# Altium schematic sheet CAN.SchDoc
size A4
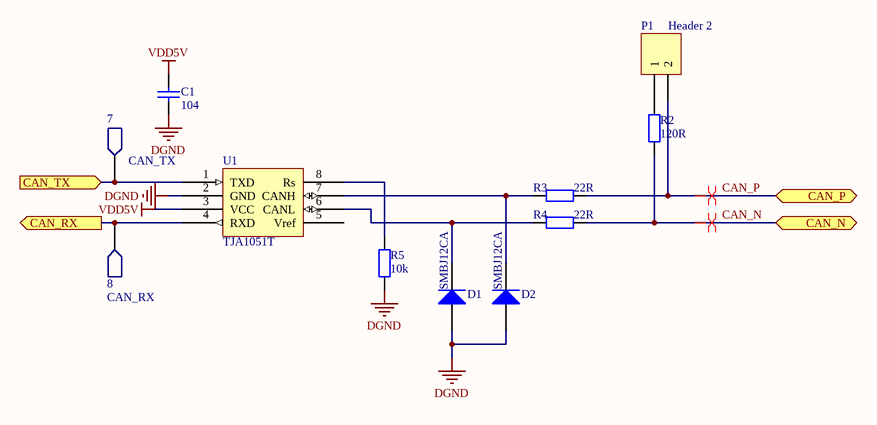
[diagram p0: CAN.SchDoc]

## Parts
7  CAN_TX  [testPoint]
8  CAN_RX  [testPoint]
C1  104  [0603_]
D1  SMBJ12CA  [SMB]
D2  SMBJ12CA  [SMB]
P1  Header 2  [HDR1X2]
R2  120R  [0603_]
R3  22R  [0603_]
R4  22R  [0603_]
R5  10k  [0603_]
U1  TJA1051T  [SOP8]

## Ports
CAN_N (bidir), CAN_P (bidir), CAN_RX (out), CAN_TX (in)

## Nets
DGND: C1.1 D1.A D2.A R5.1 U1.2(GND)
VDD5V: C1.2 U1.3(VCC)
CAN_N: R2.1 R4.1 ; port CAN_N
CAN_P: P1.2 R3.1 ; port CAN_P
CAN_RX: 8.1 U1.4(RXD) ; port CAN_RX
CAN_TX: 7.1 U1.1(TXD) ; port CAN_TX
NetD1_K: D1.K R4.2 U1.6(CANL)
NetD2_K: D2.K R3.2 U1.7(CANH)
NetP1_1: P1.1 R2.2
NetR5_2: R5.2 U1.8(Rs)

Not connected (* = marked no-connect by the designer): U1 5(Vref)

## Layout directives
differential pair: CAN_N, CAN_P

## Library data of the parts
7 8 = pad
C1 = cap: VDC_: 16V; Tolerance_: ±10%
D1 D2 = diode
P1 = Header 2: Header, 2-Pin; LatestRevisionDate: 17-Jul-2002; LatestRevisionNote: Re-released for DXP Platform.; Publisher: Altium Limited
R2-R5 = res: Tolerance_: ±5%; Power_: ?W
U1 = PCA82C250Y